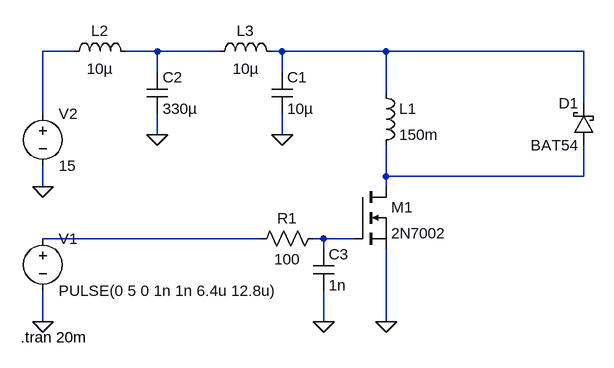
[diagram p0: schematic relay_driver.asc]
relay_driver.asc, the LTspice schematic file:
Version 4
SHEET 1 880 680
WIRE -128 -80 -176 -80
WIRE 0 -80 -48 -80
WIRE 96 -80 0 -80
WIRE 192 -80 176 -80
WIRE 352 -80 192 -80
WIRE 656 -80 352 -80
WIRE 0 -48 0 -80
WIRE 192 -48 192 -80
WIRE 352 -16 352 -80
WIRE 656 0 656 -80
WIRE -176 16 -176 -80
WIRE 0 48 0 16
WIRE 192 48 192 16
WIRE 352 112 352 64
WIRE 656 112 656 64
WIRE 656 112 352 112
WIRE -176 128 -176 96
WIRE 352 128 352 112
WIRE 160 208 -176 208
WIRE 256 208 240 208
WIRE 304 208 256 208
WIRE 256 224 256 208
WIRE -176 336 -176 288
WIRE 256 336 256 288
WIRE 352 336 352 224
FLAG -176 128 0
FLAG -176 336 0
FLAG 352 336 0
FLAG 0 48 0
FLAG 192 48 0
FLAG 256 336 0
SYMBOL voltage -176 192 R0
WINDOW 123 0 0 Left 0
WINDOW 39 0 0 Left 0
SYMATTR InstName V1
SYMATTR Value PULSE(0 5 0 1n 1n 6.4u 12.8u)
SYMBOL voltage -176 0 R0
SYMATTR InstName V2
SYMATTR Value 15
SYMBOL nmos 304 128 R0
SYMATTR InstName M1
SYMATTR Value 2N7002
SYMBOL ind 336 -32 R0
SYMATTR InstName L1
SYMATTR Value 150m
SYMATTR SpiceLine Rser=45
SYMBOL cap 176 -48 R0
SYMATTR InstName C1
SYMATTR Value 10µ
SYMATTR SpiceLine Rser=1m
SYMBOL cap -16 -48 R0
SYMATTR InstName C2
SYMATTR Value 330µ
SYMATTR SpiceLine Rser=0.5
SYMBOL schottky 672 64 R180
WINDOW 0 24 64 Left 2
WINDOW 3 24 0 Left 2
SYMATTR InstName D1
SYMATTR Value BAT54
SYMATTR Description Diode
SYMATTR Type diode
SYMBOL ind -144 -64 R270
WINDOW 0 32 56 VTop 2
WINDOW 3 5 56 VBottom 2
SYMATTR InstName L2
SYMATTR Value 10µ
SYMBOL ind 80 -64 R270
WINDOW 0 32 56 VTop 2
WINDOW 3 5 56 VBottom 2
SYMATTR InstName L3
SYMATTR Value 10µ
SYMATTR SpiceLine Rser=10m
SYMBOL res 256 192 R90
WINDOW 0 0 56 VBottom 2
WINDOW 3 32 56 VTop 2
SYMATTR InstName R1
SYMATTR Value 100
SYMBOL cap 240 224 R0
SYMATTR InstName C3
SYMATTR Value 1n
TEXT -210 360 Left 2 !.tran 20m

The netlist it stands for:
* relay_driver.asc
V1 N005 0 PULSE(0 5 0 1n 1n 6.4u 12.8u)
V2 N001 0 15
M1 N004 N006 0 0 2N7002
L1 N003 N004 150m Rser=45
C1 N003 0 10µ Rser=1m
C2 N002 0 330µ Rser=0.5
D1 N004 N003 BAT54
L2 N001 N002 10µ
L3 N002 N003 10µ Rser=10m
R1 N006 N005 100
C3 N006 0 1n
.model D D
.lib standard.dio
.model NMOS NMOS
.model PMOS PMOS
.lib standard.mos
.tran 20m
.backanno
.end